# EAGLE schematic followLineMain (EAGLE 7.7.0)
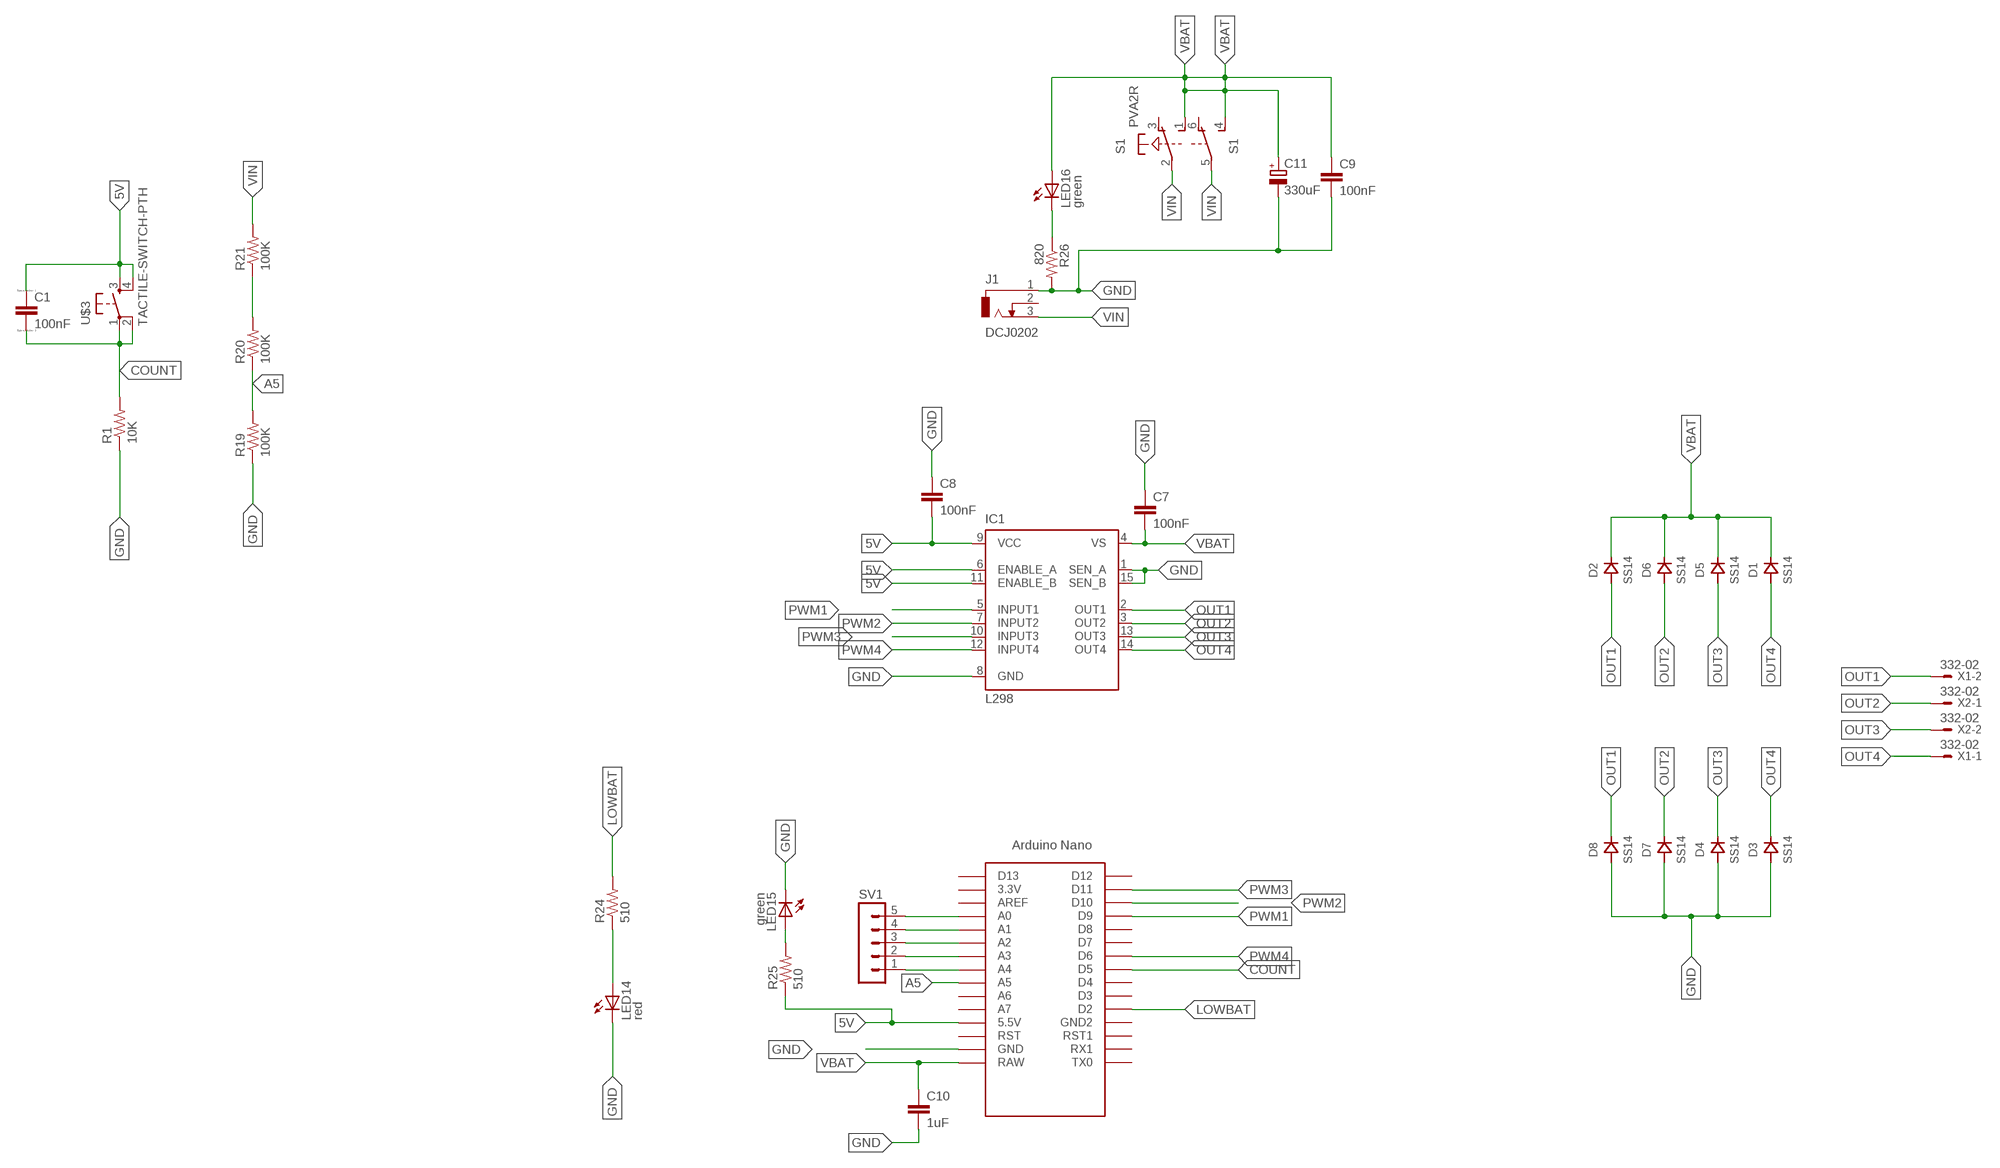
[diagram p0: schematic, sheet 1]

## Parts
C1  100nF  CC0603  [C0603]
C7  100nF  CAP0805  [0805]
C8  100nF  CAP0805  [0805]
C9  100nF  CAP0805  [0805]
C10  1uF  CAP1206  [1206]
C11  330uF  CPOL-EUE5-13  [E5-13]
D1  SS14  [DO214]
D2  SS14  [DO214]
D3  SS14  [DO214]
D4  SS14  [DO214]
D5  SS14  [DO214]
D6  SS14  [DO214]
D7  SS14  [DO214]
D8  SS14  [DO214]
IC1  L298  [MULTIWATT-15]
J1  DCJ0202  [DCJ0202]
LED14  red  LEDSML0805  [SML0805]
LED15  green  LEDSML0805  [SML0805]
LED16  green  LEDSML0805  [SML0805]
R1  10K  RESISTOR0805-RES  [0805]
R19  100K  RESISTOR0805-RES  [0805]
R20  100K  RESISTOR0805-RES  [0805]
R21  100K  RESISTOR0805-RES  [0805]
R24  510  RESISTOR0805-RES  [0805]
R25  510  RESISTOR0805-RES  [0805]
R26  820  RESISTOR0805-RES  [0805]
S1  PVA2R  [PVA2R]
SV1  MA05-1  [MA05-1]
U$1  NANO  [NANO]
U$3  TACTILE-SWITCH-PTH  [TAC-SWITCH-PTH]
X1  332-02  [332-02]
X2  332-02  [332-02]

## Nets
5V: C1.1 C8.2 IC1.6(ENABLE_A) IC1.9(VCC) IC1.11(ENABLE_B) R25.1 U$1.5V(5.5V) U$3.3 U$3.4
A5: R19.2 R20.1 U$1.A5
COUNT: C1.2 R1.2 U$1.D5 U$3.1 U$3.2
GND: C7.1 C8.1 C9.2 C10.2 C11.- D3.ANODE D4.ANODE D7.ANODE D8.ANODE IC1.1(SEN_A) IC1.8(GND) IC1.15(SEN_B) J1.1 LED14.C LED15.C R1.1 R19.1 R26.2 U$1.GND
LOWBAT: R24.2 U$1.D2
N$1: LED16.C R26.1
N$2: LED14.A R24.1
N$3: SV1.1 U$1.A4
N$4: SV1.2 U$1.A3
N$5: R20.2 R21.1
N$6: SV1.3 U$1.A2
N$7: SV1.4 U$1.A1
N$8: SV1.5 U$1.A0
N$9: LED15.A R25.2
OUT1: D2.ANODE D8.CATHODE IC1.2(OUT1) X1.2
OUT2: D6.ANODE D7.CATHODE IC1.3(OUT2) X2.1
OUT3: D4.CATHODE D5.ANODE IC1.13(OUT3) X2.2
OUT4: D1.ANODE D3.CATHODE IC1.14(OUT4) X1.1
PWM1: IC1.5(INPUT1) U$1.D9
PWM2: IC1.7(INPUT2) U$1.D10
PWM3: IC1.10(INPUT3) U$1.D11
PWM4: IC1.12(INPUT4) U$1.D6
VBAT: C7.2 C9.1 C10.1 C11.+ D1.CATHODE D2.CATHODE D5.CATHODE D6.CATHODE IC1.4(VS) LED16.A S1.1(1:S) S1.4(2:S) U$1.RAW
VIN: J1.3 R21.2 S1.2(1:P) S1.5(2:P)
Unconnected: J1.2 S1.3(1:O) S1.6(2:O) U$1.3.3V U$1.A6 U$1.A7 U$1.AREF U$1.D3 U$1.D4 U$1.D7 U$1.D8 U$1.D12 U$1.D13 U$1.GND1(GND2) U$1.ICSP1 U$1.ICSP2 U$1.ICSP3 U$1.ICSP4 U$1.ICSP5 U$1.ICSP6 U$1.RST U$1.RST1 U$1.RX1 U$1.TX0

## Library data of the parts
C1 = eagle-ltspice:C: CAPACITOR, European symbol; SPICEMODEL: NONE; SPICEPREFIX: C
C7-C10 = SparkFun-Capacitors:CAP: Capacitor Standard 0603 ceramic capacitor, and 0.1" leaded capacitor.
C11 = rcl:CPOL-EU: POLARIZED CAPACITOR, European symbol
D1-D8 = ihpcb-diode:SS14
IC1 = st-microelectronics:L298: DUAL FULL-BRIDGE DRIVER; MPN: L298N; OC_FARNELL: 1589425; OC_NEWARK: 32M1527
J1 = con-jack:DCJ0202: DC POWER JACK Source: DCJ0202.pdf; OC_FARNELL: unknown; OC_NEWARK: unknown
LED14-LED16 = led:LED: LED OSRAM: - CHIPLED LG R971, LG N971, LY N971, LG Q971, LY Q971, LO R971, LY R971 LH N974, LH R974 LS Q976, LO Q976, LY Q976 LO Q996 - Hyper CHIPLED LW Q18S LB Q993, LB Q99A, LB R99A - SideLED LS A670, LO A670, LY A670, LG A670, LP A670 LB A673, LV A673, LT A673, LW A673 LH A674 LY A675 LS A676, LA A676, LO A676, LY A676, LW A676 LS A679, LY A679, LG A679 - Hyper Micro SIDELED® LS Y876, LA Y876, LO Y876, LY Y876 LT Y87S - SmartLED LW L88C, LW L88S LB L89C, LB L89S, LG L890 LS L89K, LO L89K, LY L89K LS L896, LA L896, LO L896, LY L896 - TOPLED LS T670, LO T670, LY T670, LG T670, LP T670 LSG T670, LSP T670, LSY T670, LOP T670, LYG T670 LG T671, LOG T671, LSG T671 LB T673, LV T673, LT T673, LW T673 LH T674 LS T676, LA T676, LO T676, LY T676, LB T676, LH T676, LSB T676, LW T676 LB T67C, LV T67C, LT T67C, LS T67K, LO T67K, LY T67K, LW E67C LS E67B, LA E67B, LO E67B, LY E67B, LB E67C, LV E67C, LT E67C LW T67C LS T679, LY T679, LG T679 LS T770, LO T770, LY T770, LG T770, LP T770 LB T773, LV T773, LT T773, LW T773 LH T774 LS E675, LA E675, LY E675, LS T675 LS T776, LA T776, LO T776, LY T776, LB T776 LHGB T686 LT T68C, LB T68C - Hyper Mini TOPLED® LB M676 - Mini TOPLED Santana® LG M470 LS M47K, LO M47K, LY M47K Source: http://www.osram.convergy.de LUXEON: - LUMILED® LXK2-PW12-R00, LXK2-PW12-S00, LXK2-PW14-U00, LXK2-PW14-V00 LXK2-PM12-R00, LXK2-PM12-S00, LXK2-PM14-U00 LXK2-PE12-Q00, LXK2-PE12-R00, LXK2-PE12-S00, LXK2-PE14-T00, LXK2-PE14-U00 LXK2-PB12-K00, LXK2-PB12-L00, LXK2-PB12-M00, LXK2-PB14-N00, LXK2-PB14-P00, LXK2-PB14-Q00 LXK2-PR12-L00, LXK2-PR12-M00, LXK2-PR14-Q00, LXK2-PR14-R00 LXK2-PD12-Q00, LXK2-PD12-R00, LXK2-PD12-S00 LXK2-PH12-R00, LXK2-PH12-S00 LXK2-PL12-P00, LXK2-PL12-Q00, LXK2-PL12-R00 Source: www.luxeon.com KINGBRIGHT: KA-3528ASYC Source: www.kingbright.com
R1 R19-R21 R24-R26 = SparkFun-Passives:RESISTOR: Resistor Basic schematic elements and footprints for 0603, 1206, and PTH resistors.
S1 = switch-misc:PVA2R: ITT SWITCH
SV1 = con-lstb:MA05-1: PIN HEADER; OC_FARNELL: unknown; OC_NEWARK: unknown
U$1 = Arduino-clone:NANO: Arduino Nano
U$3 = GeekAmmo:TACTILE-SWITCH: Tactile Switch 4 Pins, SPST NO
X1 X2 = con-garry:332-02: 2 Pin - 2mm Dual Row Source: www.mpe-connector.de / garry_shortform_2012.pdf